# EAGLE design Senslope Alpha 4.8 (EAGLE 8.6.0)
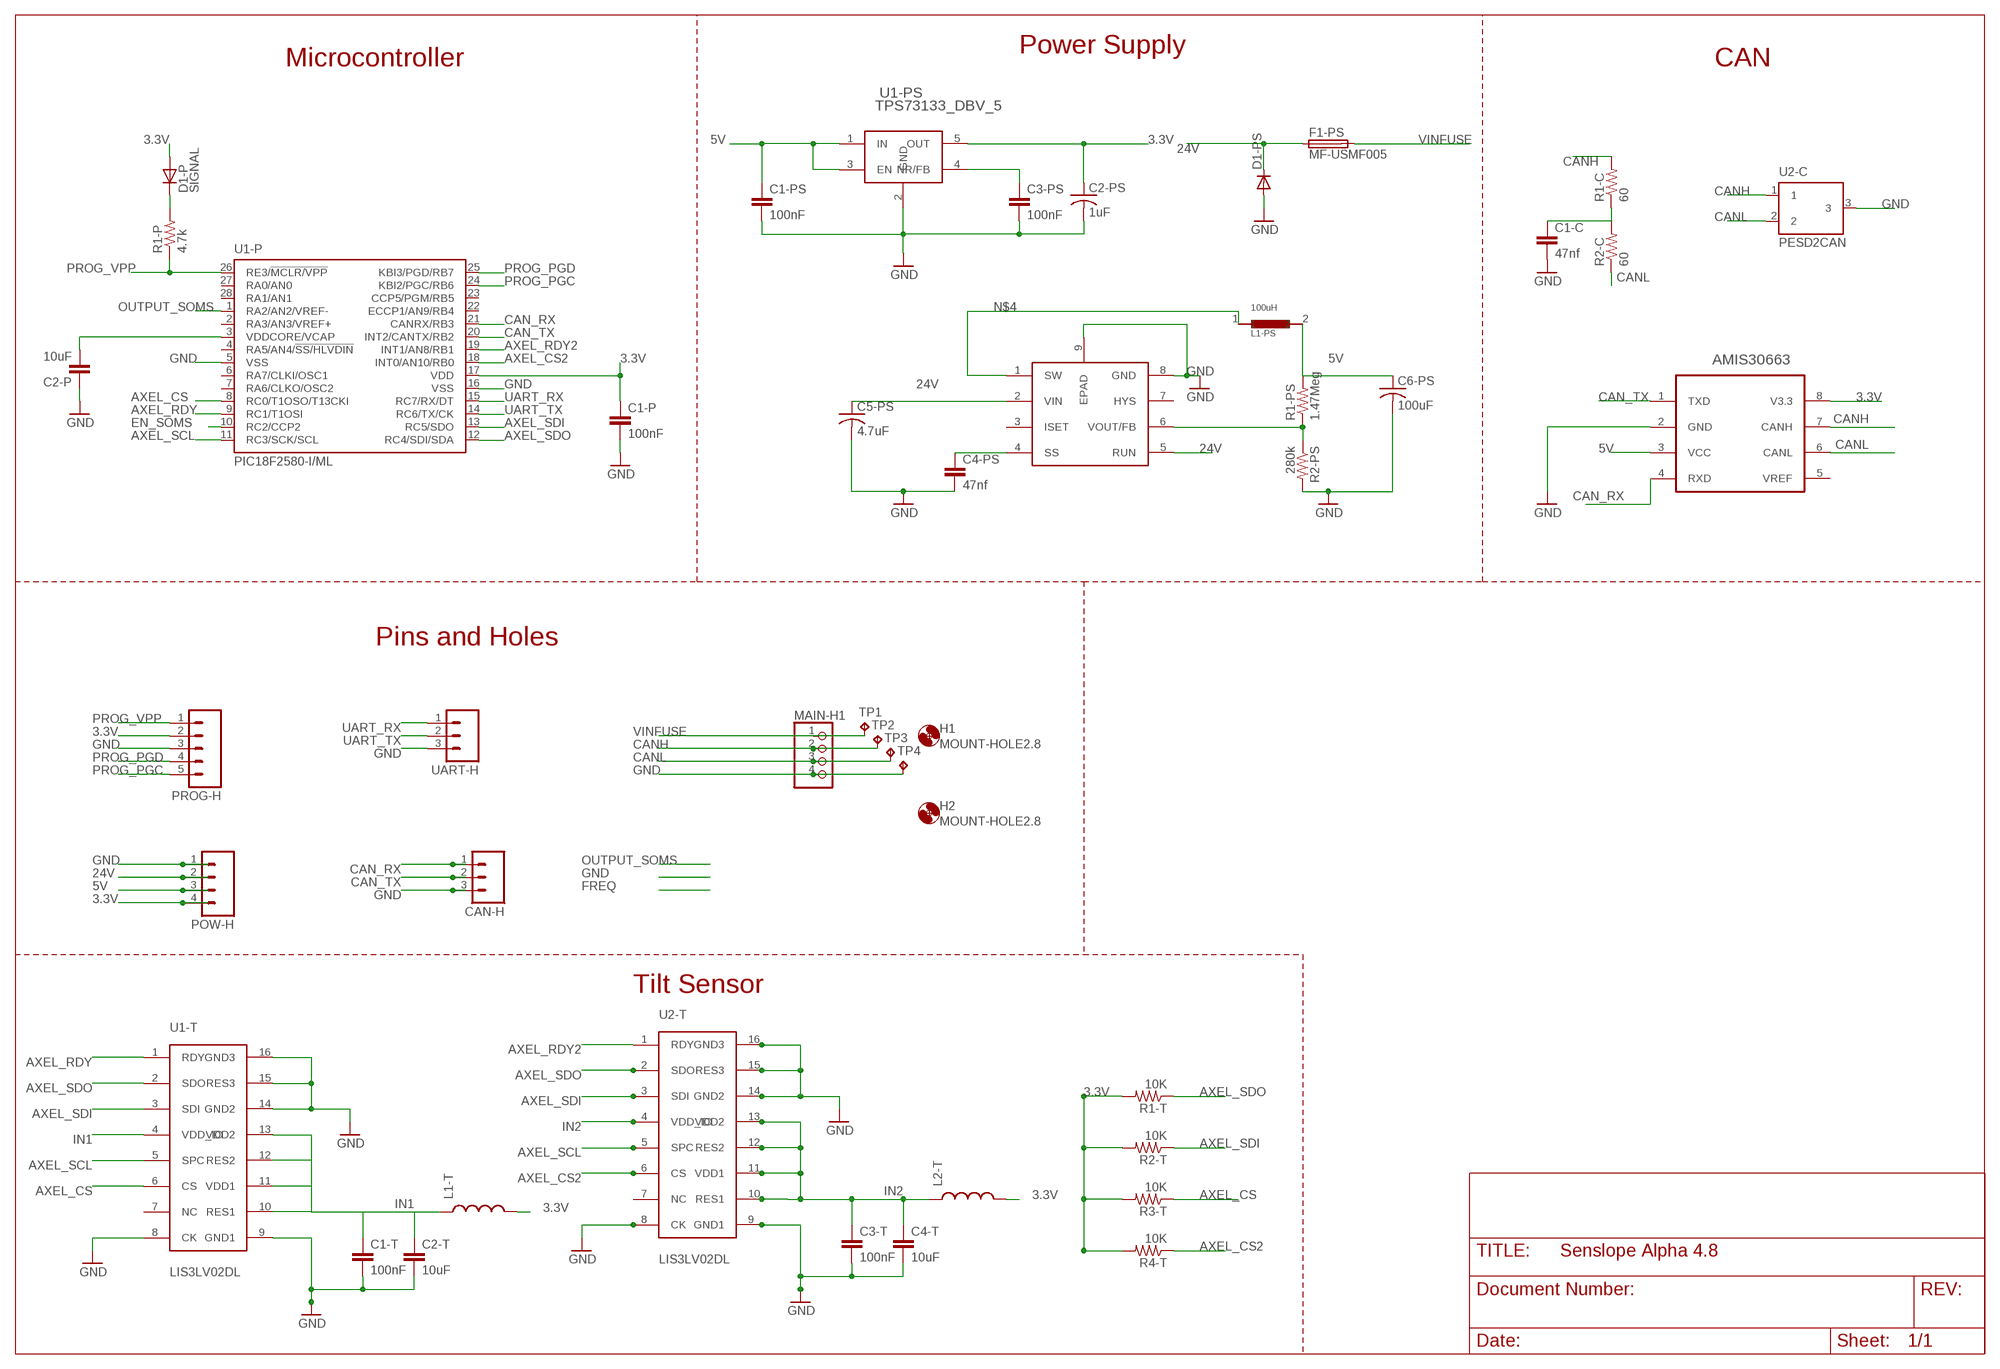
[diagram p0: schematic, sheet 1]

## Parts
C1-C  47nf  C-EUC0805  [C0805]
C1-P  100nF  C-EUC0603  [C0603]
C1-PS  100nF  C-EUC0603  [C0603]
C1-T  100nF  C-EUC0402  [C0402]
C2-P  10uF  C-EUC0603  [C0603]
C2-PS  1uF  C-USC0402  [C0402]
C2-T  10uF  C-EUC0402  [C0402]
C3-PS  100nF  C-EUC0603  [C0603]
C3-T  100nF  C-EUC0402  [C0402]
C4-PS  47nf  C-EUC0805  [C0805]
C4-T  10uF  C-EUC0402  [C0402]
C5-PS  4.7uF  C-USC1206K  [C1206K]
C6-PS  100uF  C-USC1210K  [C1210K]
CAN-H  UART  M031X03_NO_SILK  [1X03_NO_SILK]
D1-P  SIGNAL  DIODE0603  [DIODE-0603]
D1-PS  DIODE-DO-214AC  [DO-214AC]
F1-PS  MF-USMF005  MF-USMF075  [1210]
H1  MOUNT-HOLE2.8  [2,8]
H2  MOUNT-HOLE2.8  [2,8]
L1-PS  100uH  LQH32PN101MN0L  [1210]
L1-T  H2  INDUCTOR0402  [C0402]
L2-T  H1  INDUCTOR0402  [C0402]
MAIN-H1  PINHD-1X04_2.54  [1X04]
POW-H  M041X04_NO_SILK  [1X04_NO_SILK]
PROG-H  M05PTH  [1X05]
R1-C  60  R-US_R0805  [R0805]
R1-P  4.7k  R-US_R0603  [R0603]
R1-PS  1.47Meg  R-US_R0805  [R0805]
R1-T  10K  R-US_R0603  [R0603]
R2-C  60  R-US_R0805  [R0805]
R2-PS  280k  R-US_R0805  [R0805]
R2-T  10K  R-US_R0603  [R0603]
R3-T  10K  R-US_R0603  [R0603]
R4-T  10K  R-US_R0603  [R0603]
TP1  TPTP10SQ  [TP10SQ]
TP2  TPTP10SQ  [TP10SQ]
TP3  TPTP10SQ  [TP10SQ]
TP4  TPTP10SQ  [TP10SQ]
U1-P  PIC18F2580-I/ML  [QFN28-ML_6X6MM]
U1-PS  TPS73133_DBV_5  [DBV5]
U1-T  LIS3LV02DL  [LGA16]
U2  AMIS30663CAN  [SOIC8]
U2-C  PESD2CAN  [SOT23]
U2-PS  LTC3631-5  LTC3631  [MSOP8E]
U2-T  LIS3LV02DL  [LGA16]
UART-H  UART  M031X03_NO_SILK  [1X03_NO_SILK]

## Nets
3.3V: C1-P.1 C2-PS.1 D1-P.A L1-T.2 L2-T.2 POW-H.4 PROG-H.2 R1-T.2 R2-T.2 R3-T.2 R4-T.2 U1-P.17(VDD) U1-PS.5(OUT) U2.8(V3.3)
5V: C1-PS.1 C6-PS.1 L1-PS.2 POW-H.3 R1-PS.2 U1-PS.1(IN) U1-PS.3(EN) U2.3(VCC)
24V: C5-PS.1 D1-PS.1(C) F1-PS.1 POW-H.2 U2-PS.2(VIN) U2-PS.5(RUN)
AXEL_CS: R3-T.1 U1-P.8(RC0/T1OSO/T13CKI) U1-T.6(CS)
AXEL_CS2: R4-T.1 U1-P.18(INT0/AN10/RB0) U2-T.6(CS)
AXEL_RDY: U1-P.9(RC1/T1OSI) U1-T.1(RDY)
AXEL_RDY2: U1-P.19(INT1/AN8/RB1) U2-T.1(RDY)
AXEL_SCL: U1-P.11(RC3/SCK/SCL) U1-T.5(SPC) U2-T.5(SPC)
AXEL_SDI: R2-T.1 U1-P.13(RC5/SDO) U1-T.3(SDI) U2-T.3(SDI)
AXEL_SDO: R1-T.1 U1-P.12(RC4/SDI/SDA) U1-T.2(SDO) U2-T.2(SDO)
CAN_RX: CAN-H.1 U1-P.21(CANRX/RB3) U2.4(RXD)
CAN_TX: CAN-H.2 U1-P.20(INT2/CANTX/RB2) U2.1(TXD)
CANH: MAIN-H1.2 R1-C.2 TP2.TP U2-C.1 U2.7(CANH)
CANL: MAIN-H1.3 R2-C.1 TP3.TP U2-C.2 U2.6(CANL)
EN_SOMS: U1-P.10(RC2/CCP2)
GND: C1-C.2 C1-P.2 C1-PS.2 C1-T.2 C2-P.1 C2-PS.2 C2-T.2 C3-PS.2 C3-T.2 C4-PS.2 C4-T.2 C5-PS.2 C6-PS.2 CAN-H.3 D1-PS.2(A) MAIN-H1.4 POW-H.1 PROG-H.3 R2-PS.2 TP4.TP U1-P.5(VSS) U1-P.16(VSS) U1-PS.2(GND) U1-T.8(CK) U1-T.9(GND1) U1-T.14(GND2) U1-T.15(RES3) U1-T.16(GND3) U2-C.3 U2-PS.8(GND) U2-PS.9(EPAD) U2-T.8(CK) U2-T.9(GND1) U2-T.14(GND2) U2-T.15(RES3) U2-T.16(GND3) U2.2(GND) UART-H.3
IN1: C1-T.1 C2-T.1 L1-T.1 U1-T.4(VDD_IO) U1-T.10(RES1) U1-T.11(VDD1) U1-T.12(RES2) U1-T.13(VDD2)
IN2: C3-T.1 C4-T.1 L2-T.1 U2-T.4(VDD_IO) U2-T.10(RES1) U2-T.11(VDD1) U2-T.12(RES2) U2-T.13(VDD2)
N$3: C1-C.1 R1-C.1 R2-C.2
N$4: L1-PS.1 U2-PS.1(SW)
N$5: C3-PS.1 U1-PS.4(NR/FB)
N$6: R1-PS.1 R2-PS.1 U2-PS.6(VOUT/FB)
N$7: D1-P.C R1-P.2
N$8: C4-PS.1 U2-PS.4(SS)
N$19: C2-P.2 U1-P.3(VDDCORE/VCAP)
OUTPUT_SOMS: U1-P.1(RA2/AN2/VREF-)
PROG_PGC: PROG-H.5 U1-P.24(KBI2/PGC/RB6)
PROG_PGD: PROG-H.4 U1-P.25(KBI3/PGD/RB7)
PROG_VPP: PROG-H.1 R1-P.1 U1-P.26(RE3/!MCLR/VPP)
UART_RX: U1-P.15(RC7/RX/DT) UART-H.1
UART_TX: U1-P.14(RC6/TX/CK) UART-H.2
VINFUSE: F1-PS.2 MAIN-H1.1 TP1.TP
Unconnected: U1-P.2(RA3/AN3/VREF+) U1-P.4(RA5/AN4/!SS/HLVDIN) U1-P.6(RA7/CLKI/OSC1) U1-P.7(RA6/CLKO/OSC2) U1-P.22(ECCP1/AN9/RB4) U1-P.23(CCP5/PGM/RB5) U1-P.27(RA0/AN0) U1-P.28(RA1/AN1) U1-T.7(NC) U2-PS.3(ISET) U2-PS.7(HYS) U2-T.7(NC) U2.5(VREF)

## Notes on the sheet
- Power Supply
- Microcontroller | CAN
- Pins and Holes
- Tilt Sensor

## Library data of the parts
C1-C C1-PS C1-T C2-P C2-T C3-PS C3-T C4-PS C4-T = rcl:C-EU: CAPACITOR, European symbol
C1-P = resistor:C-EU: CAPACITOR, European symbol
C2-PS C5-PS C6-PS = rcl:C-US: CAPACITOR, American symbol
CAN-H UART-H = SparkFun-Connectors:M03: Header 3 Standard 3-pin 0.1" header. Use with straight break away headers (SKU : PRT-00116), right angle break away headers (PRT-00553), swiss pins (PRT-00743), machine pins (PRT-00117), and female headers (PRT-00115). Molex polarized connector foot print use with SKU : PRT-08232 with associated crimp pins and housings.
D1-P = signal_diode:DIODE: Signal diode
D1-PS = dp_devices:DIODE: Various Diode Packages
F1-PS = DRMScustomlib:MF-USMF075
H1 H2 = holes:MOUNT-HOLE: MOUNTING HOLE with drill center marker
L1-PS = 1210_inductor:LQH32PN101MN0L
L1-T L2-T = SparkFun:INDUCTOR: Inductors Basic Inductor/Choke - 0603 and 1206. Footprints are not proven and vary greatly between part numbers.
MAIN-H1 = pinhead-2:PINHD-1X04: PIN HEADER
POW-H = SparkFun-Connectors:M04: Header 4 Standard 4-pin 0.1" header. Use with straight break away headers (SKU : PRT-00116), right angle break away headers (PRT-00553), swiss pins (PRT-00743), machine pins (PRT-00117), and female headers (PRT-00115). Molex polarized connector foot print use with SKU : PRT-08231 with associated crimp pins and housings. 1MM SMD Version SKU: PRT-10208
PROG-H = SparkFun-Connectors:M05: Header 5 Standard 5-pin 0.1" header. Use with straight break away headers (SKU : PRT-00116), right angle break away headers (PRT-00553), swiss pins (PRT-00743), machine pins (PRT-00117), and female headers (PRT-00115). Molex polarized connector foot print use with SKU : PRT-08230 with associated crimp pins and housings.
R1-C R1-PS R2-C R2-PS = rcl:R-US_: RESISTOR, American symbol
R1-P R1-T R2-T R3-T R4-T = resistor:R-US_: RESISTOR, American symbol
TP1-TP4 = testpad:TP: Test pad
U1-P = PIC18f25k80:PIC18F2*80: 28-Pin Enhanced Flash Microcontrollers with ECAN(TM) Technology 10-Bit A/D and nanoWatt Technology Source: http://www.microchip.com .. 39637a.pdf; MF: MICROCHIP; MPN: PIC18F2580-I/ML; OC_FARNELL: 1556180; OC_NEWARK: 71J7242
U1-PS = DRMScustomlib:TPS73133_DBV_5; DATASHEETURL: http://www.ti.com/lit/gpn/TPS73133; DESCRIPTION: Single Output LDO, 150mA, Fixed(3.3V), Cap free, Low Noise, Fast Transient Response; FAMILY_NAME: SINGLE CHANNEL LDO; GENERIC_PART_NUMBER: TPS73133; INDUSTRY_STD_PKG_TYPE: SOT-23; MANUFACTURER: Texas Instruments; MANUFACTURER_PART_NUMBER: tps73133_dbv_5; PACKAGE_DESIGNATOR: DBV; PIN_COUNT: 5; VENDOR: Texas Instruments
U1-T U2-T = LIS3LV02DL:LIS3LV02DL
U2 = khr_lib4:AMIS30663CAN: https://www.onsemi.com/pub/Collateral/AMIS-30663-D.PDF; MPN: AMIS30663; OC_FARNELL: -; OC_NEWARK: 75C7726; PACKAGE: SOIC-8; SUPPLIER: On Semiconductor
U2-C = PESD2CAN:PESD2CAN
U2-PS = DRMScustomlib:LTC3631

## Board
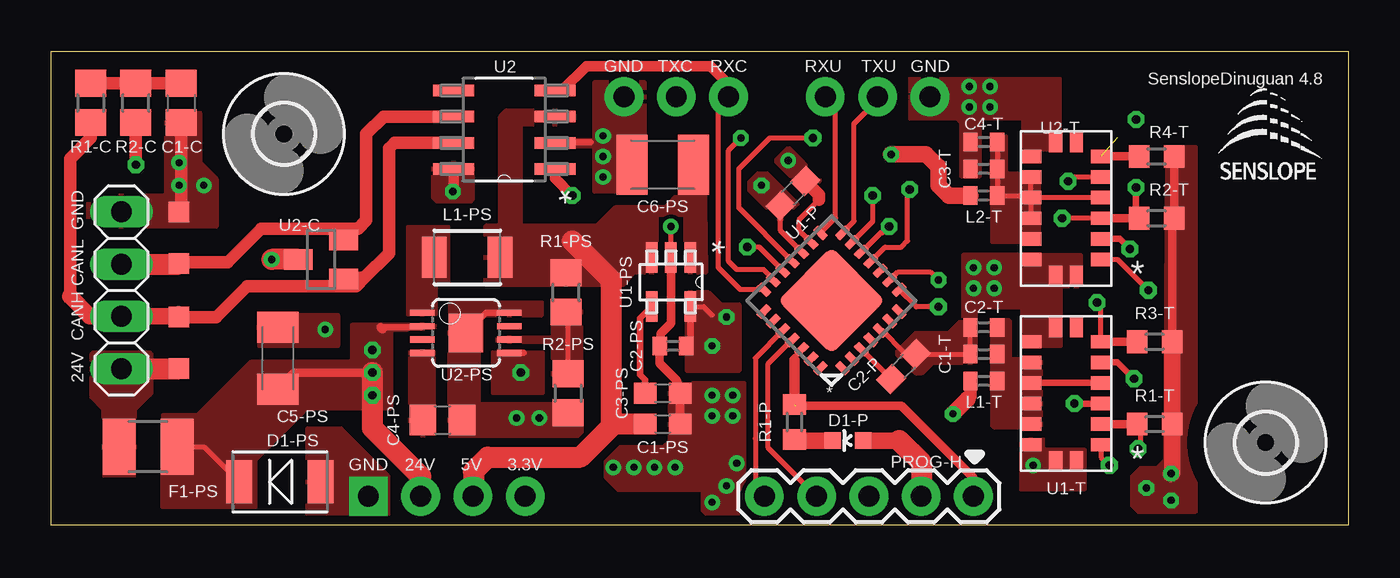
[diagram p1: board, top side]
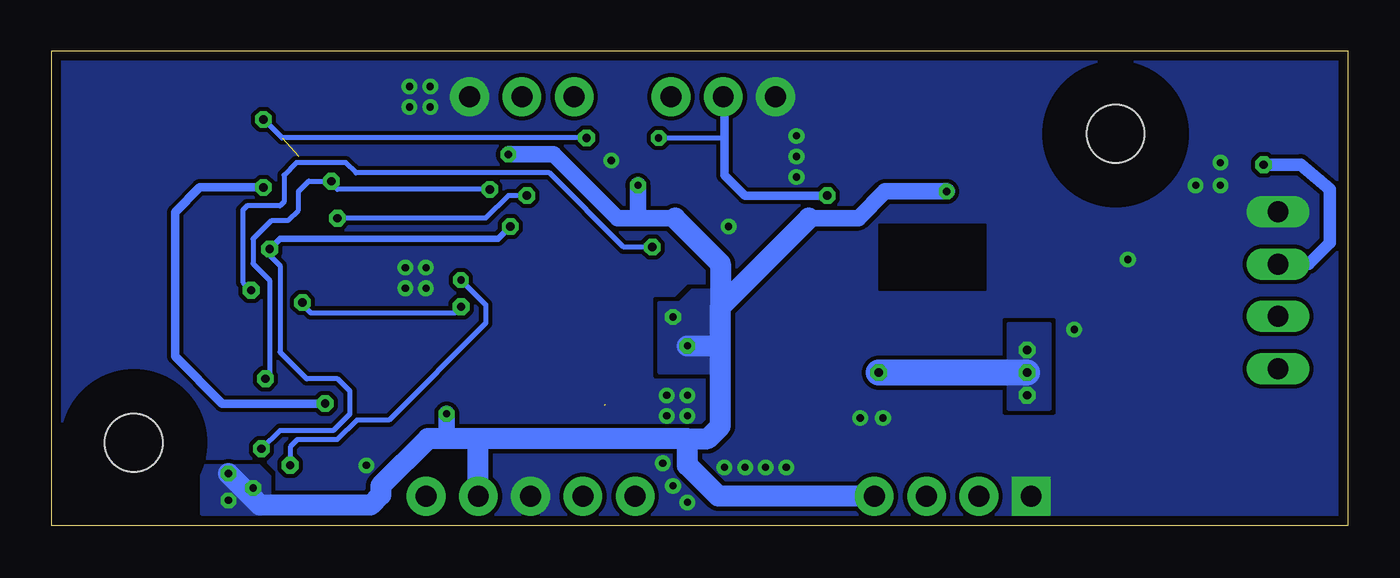
[diagram p2: board, bottom side, seen from below]

Size 63 x 23 mm. Coordinates in mm from the lower left corner, seen from the top.
Outline: 63,23 63,0 0,0 0,23 63,23
Copper layers (1*16): Top 0.035mm / dielectric 0.5mm / Route 0.035mm
Design rules "default *": minimum track width 6mil, minimum drill 6mil, track to track 8mil, track to pad 8mil, pad to pad 8mil, via to via 8mil, smd to smd 0mil, copper to edge 18mil, drill to drill 8mil, minimum pad ring 10mil, minimum via ring 8mil, stop-mask expansion 4mil, vias tented up to drill 0mil, thermal gap 0mil
bRestrict: area 17.6,11.4 to 22.8,14.6

### Footprints (pad centres in the part's own frame; a part is rotated, then mirrored left to right if it is on the bottom)
C0805 = smd 1.3 x 1.5: 1 -0.95,0; 2 0.95,0
C0603 = smd 1.1 x 1: 1 -0.85,0; 2 0.85,0
C0402 = smd 0.7 x 0.9: 1 -0.65,0; 2 0.65,0
C1206K = smd 1.5 x 2: 1 -1.5,0; 2 1.5,0
C1210K = smd 1.5 x 2.9: 1 -1.5,0; 2 1.5,0
1X03_NO_SILK = drill 1.016 pad 1.88: 1 0,0; 2 2.54,0; 3 5.08,0
DIODE-0603 = smd 0.8 x 0.8: A 0,-0.75; C 0,0.75
DO-214AC = smd 1.27 x 2.1: 1 -1.98,0; 2 1.98,0
1210 = smd 1.6 x 2.7: 1 -1.4,0; 2 1.4,0
2,8 = hole 2.8: 0,0
1210' = smd 1.2 x 2: 1 -1.6,0; 2 1.6,0
1X04 = drill 1.016 long: 1 -3.81,0; 2 -1.27,0; 3 1.27,0; 4 3.81,0
1X04_NO_SILK = drill 1.016 pad 1.88 square: 1 0,0 | drill 1.016 pad 1.88: 2 2.54,0; 3 5.08,0; 4 7.62,0
1X05 = drill 1.016 pad 1.88: 1 0,0; 2 2.54,0; 3 5.08,0; 4 7.62,0; 5 10.16,0
R0805 = smd 1.3 x 1.5: 1 -0.95,0; 2 0.95,0
R0603 = smd 1 x 1.1: 1 -0.85,0; 2 0.85,0
TP10SQ = smd 1 x 1: TP 0,0
QFN28-ML_6X6MM = smd 0.7 x 0.35: 1 -2.7,1.95; 2 -2.7,1.3; 3 -2.7,0.65; 4 -2.7,0; 5 -2.7,-0.65; 6 -2.7,-1.3; 7 -2.7,-1.95; 15 2.7,-1.95; 16 2.7,-1.3; 17 2.7,-0.65; 18 2.7,0; 19 2.7,0.65; 20 2.7,1.3; 21 2.7,1.95 | smd 0.35 x 0.7: 8 -1.95,-2.7; 9 -1.3,-2.7; 10 -0.65,-2.7; 11 0,-2.7; 12 0.65,-2.7; 13 1.3,-2.7; 14 1.95,-2.7; 22 1.95,2.7; 23 1.3,2.7; 24 0.65,2.7; 25 0,2.7; 26 -0.65,2.7; 27 -1.3,2.7; 28 -1.95,2.7 | smd 3.7 x 3.7: EXP 0,0
DBV5 = smd 1.473 x 0.559: 1 -1.194,0.94; 2 -1.194,0; 3 -1.194,-0.94; 4 1.194,-0.94; 5 1.194,0.94
LGA16 = smd 0.975 x 0.65: 1 -1.7,2.5; 2 -1.7,1.5; 3 -1.7,0.5; 4 -1.7,-0.5; 5 -1.7,-1.5; 6 -1.7,-2.5; 9 1.7,-2.5; 10 1.7,-1.5; 11 1.7,-0.5; 12 1.7,0.5; 13 1.7,1.5; 14 1.7,2.5 | smd 0.65 x 0.975: 7 -0.5,-3.2; 8 0.5,-3.2; 15 0.5,3.3; 16 -0.5,3.3
SOIC8 = smd 1.981 x 0.559: 1 -0.464,4.405; 2 -0.464,3.135; 3 -0.464,1.865; 4 -0.464,0.595; 5 4.464,0.595; 6 4.464,1.865; 7 4.464,3.135; 8 4.464,4.405
SOT23 = smd 1 x 1.4: 1 -0.95,-1.1; 2 0.95,-1.1; 3 0,1.1
MSOP8E = smd 0.3 x 1.2: 1 0.294,0.427; 2 0.944,0.427; 3 1.594,0.427; 4 2.244,0.427; 5 2.244,4.652; 6 1.594,4.652; 7 0.944,4.652; 8 0.294,4.652 | smd 1.88 x 1.676: 9 1.27,2.54

### Placement (x,y rotation side)
C1-C  6.3,20.5 270 top
C1-P  36.03,16.11 45 top
C1-PS  29.7,4.9 0 top
C1-T  45.3,8.3 180 top
C2-P  41.4,7.7 225 top
C2-PS  30.2,8.7 180 top
C2-T  45.3,9.6 180 top
C3-PS  29.7,6.4 0 top
C3-T  45.3,17.3 180 top
C4-PS  19,5.1 0 top
C4-T  45.3,18.6 180 top
C5-PS  11,8.1 90 top
C6-PS  29.7,17.5 180 top
CAN-H  32.9,20.8 180 top
D1-P  38.7,4.1 90 top
D1-PS  11.1,2.1 0 top
F1-PS  4.7,3.8 180 top
H1  59,4 0 top
H2  11.3,19 0 top
L1-PS  100uH  [1210']  20.2,13 0 top
L1-T  45.3,7 180 top
L2-T  45.3,16 180 top
MAIN-H1  3.4,11.4 90 top
POW-H  15.4,1.4 0 top
PROG-H  44.8,1.4 180 top
R1-C  1.9,20.5 270 top
R1-P  36.1,5 270 top
R1-PS  25,11.3 90 top
R1-T  53.6,4.9 0 top
R2-C  4.1,20.5 90 top
R2-PS  25.1,6.4 270 top
R2-T  53.7,14.9 0 top
R3-T  53.6,8.9 0 top
R4-T  53.7,17.9 0 top
TP1  6.2,7.6 0 top
TP2  6.2,10.1 0 top
TP3  6.2,12.7 0 top
TP4  6.2,15.2 0 top
U1-P  37.9,10.9 135 top
U1-PS  30.1,11.8 270 top
U1-T  49.3,6.4 180 top
U2  24,21.7 180 top
U2-C  13.1,12.9 90 top
U2-PS  17.6,10.6 270 top
U2-T  49.3,15.4 180 top
U$1  [LOGO_SML_TNAME]  59,18.4 0 top
UART-H  37.6,20.8 0 top

### Tracks (layer width: path | path; a pad name or v marks a point on that pad's centre or on a via)
3.3V  (via drill 0.35)
  Top 0.254: U1-PS.5 31.69,10.61 32.1,10.2 | U1-P.17 35.43,14.29 C1-P.1
  Top 0.305: U1-PS.5 31.04,8.89 C2-PS.1
  Top 0.406: R4-T.2 R2-T.2 54.45,14.8 R3-T.2
  Top 0.508: U2.8 19.54,16.24 v19.5,16.2
  Top 0.61: L1-T.2 44.65,6.25 44.5,6.1
  Top 0.813: R3-T.2 R1-T.2 54.45,2.55 v54.4,2.5 | L2-T.2 43.6,16 43.1,16.5 43.1,17.4 42.5,18 v40.8,18 | D1-P.A 41.2,4.1 | 44.5,6.1 v43.8,5.4
  Top 1.016: PROG-H.2 42.26,3.04 41.2,4.1
  Route 0.813: v43.8,5.4 43.8,4.2 | v40.8,18 38.6,18 35.5,14.9 34.5,14.9 | 34.5,14.9 32.7,14.9 | 26.2,14.9 23.8,14.9 22.5,16.2 v19.5,16.2 | v34.5,16.5 34.5,14.9
  Route 1.016: POW-H.4 30.6,1.4 32.1,2.9 32.1,4.2 | 42.3,4.2 43.8,4.2 44.7,4.2 47,1.9 47,1.47 47.5,0.96 52.87,0.96 v54.4,2.5 | PROG-H.2 42.26,4.16 42.3,4.2 | 30.5,8.7 30.5,4.8 31.1,4.2 32.1,4.2 | 30.5,8.7 30.5,10.6 | 30.5,10.6 26.2,14.9 | 32.7,14.9 30.5,12.7 30.5,10.6 | v32.1,8.7 30.5,8.7 | 32.1,4.2 42.3,4.2
  other vias: 54.4,1.2 53.2,1.8 32.8,10.1
  pour Top (isolate 0.254): 54.2,18.4 55.6,18.4 55.6,0.6 52.8,0.6 52.5,0.9 52.5,2.4 52.9,2.8 53.7,2.8 54.1,3.2
  pour Top: 30.9,11.3 31.9,11.3 32.5,10.7 33.4,10.7 33.4,7.5 30.9,7.5
  pour Top: 35.4,14.7 33.9,16.2 33.9,16.7 34.3,17.1 34.8,17.1 36.3,15.6
  pour Route (rank 2): 52.9,2.9 52.4,2.4 52.4,0.9 52.8,0.5 55.7,0.5 55.7,2.9
  pour Top: 18.5,17.6 18.5,15.9 18.7,15.7 20.4,15.7 20.5,15.8 20.5,17.6
  pour Route: 31.3,11.4 31.9,11.4 32.5,10.8 33.5,10.8 33.5,7.4 30.9,7.4 30.9,11.4
5V
  Top 1.016: 25.3,13.8 27.2,11.9 27.2,4.9 | 27.2,4.9 27.2,4.8 25.7,3.3 21.2,3.3 20.5,2.6 20.5,1.42 POW-H.3 | C1-PS.1 27.2,4.9
  pour Top: 21.1,14.5 21.1,11.7 27.8,11.7 28.3,12.3 29.4,12.3 29.4,15.1 30.8,15.1 30.8,12.3 31.8,12.3 31.7,18.8 30.6,18.8 30.6,16.2 29.8,15.4 27.4,15.4 26.5,14.5 22.8,14.5 22.8,19.5 25.4,19.5 25.4,20.1 22.1,20.1 21.8,19.8 21.8,14.5
24V  (via drill 0.4)
  Top 0.254: F1-PS.1 7.42,3.8 D1-PS.1
  Top 0.305: 16,9.6 17.97,9.6 U2-PS.2 | U2-PS.5 22.94,8.36
  Top 0.406: 16.1,9.5 16,9.6 | v15.6,7.4 11.8,7.4 C5-PS.1
  Top 1.016: POW-H.2 17.94,2.36 15.6,4.7 v15.6,7.4
  Route 1.27: v15.6,7.4 v22.8,7.4
  other vias: 15.6,6.3 15.6,8.5
  pour Top (isolate 0.254): 5.4,5.3 5.4,0.9 9.9,0.9 9.9,3.2 12.4,5.7 16.5,5.7 16.5,9.5 18.6,9.5 18.6,9.7 14.6,9.7 14.6,7.9 9.7,7.9 7.1,5.3
  pour Top: 21.4,8.4 21.4,6.4 23.9,6.4 23.9,8.4
  pour Route: 16.5,5.6 16.5,9.8 14.5,9.8 14.5,5.6
AXEL_CS  (via drill 0.4)
  Top 0.254: U1-T.6 51,10.6 v50.8,10.8 | v43.1,10.6 42.02,10.6 U1-P.8
  Top 0.406: R3-T.1 U1-T.6
  Route 0.254: v50.8,10.8 50.8,10.7 50.4,10.3 43.4,10.3 v43.1,10.6
AXEL_CS2  (via drill 0.4)  (1 unrouted)
  Top 0.254: U1-P.18 33.4,15.4 33.4,17.3 34.9,18.8 v37,18.8 | 52.9,17.95 R4-T.1
  Top 0.406: U2-T.6 R4-T.1
  Route 0.254: v37,18.8 51.8,18.8 v52.7,19.7
AXEL_RDY  (via drill 0.35, 0.4)
  Top 0.254: U1-T.1 51,3.3 v51.4,2.9 | 40.79,11.89 U1-P.9 41.14,12.3 42.7,12.3 v43.1,11.9
  Route 0.254: v43.1,11.9 41.9,10.7 41.9,9.8 46.6,5.1 48.15,5.1 49.11,4.14 51.06,4.14 51.4,3.8 v51.4,2.9
AXEL_RDY2  (via drill 0.4)
  Top 0.254: U1-P.19 35.53,12.37 34.4,13.5 v33.8,13.5 | U2-T.1 51.8,12.9 v53.3,11.4
  Route 0.254: v53.3,11.4 53.7,11.8 53.7,15.3 53.5,15.5 51.9,15.5 51.7,15.7 51.7,17 51.1,17.6 48.7,17.6 48.2,17.1 38.8,17.1 35.2,13.5 v33.8,13.5
AXEL_SCL  (via drill 0.4)
  Top 0.254: U1-P.11 40.5,13.5 41.3,13.5 41.6,13.8 41.6,16.2 v41.7,16.3 | U2-T.5 49.6,16.9 v49.4,16.7
  Top 0.305: U1-T.5 51.8,7.9 v52.6,7.1
  Route 0.254: v52.6,7.1 52.4,7.3 52.4,11.9 53.2,12.7 53.2,13.9 52.3,14.8 51.5,14.8 51,15.3 51,16.2 50.5,16.7 v49.4,16.7 49.4,16.6 49.1,16.3 v41.7,16.3
AXEL_SDI  (via drill 0.4)
  Top 0.254: U2-T.3 v49.1,14.9 | v39.9,16 39.9,14.74 U1-P.13
  Top 0.305: U1-T.3 v49.7,5.9 | R2-T.1 52.7,15.05 v52.7,16.4
  Top 0.406: U2-T.3 R2-T.1
  Route 0.254: v39.9,16 40.8,16 41.9,14.9 v49.1,14.9
  Route 0.406: v52.7,16.4 55.8,16.4 57,15.2 57,8.2 54.7,5.9 v49.7,5.9
AXEL_SDO  (via drill 0.4)
  Top 0.254: U1-P.12 39.37,13.27 40.3,14.2 40.4,14.2 v40.7,14.5 | R1-T.1 52.9,4.75 52.9,3.8 v52.8,3.7
  Top 0.305: U2-T.2 51.9,13.9 v52.4,13.4
  Top 0.406: U1-T.2 R1-T.1 52.8,4.9
  Route 0.254: v52.4,13.4 52.4,13.1 51.9,12.6 51.9,8.4 50.6,7.1 49.1,7.1 48.5,6.5 48.5,5.4 49.3,4.6 51.9,4.6 v52.8,3.7
  Route 0.305: v52.4,13.4 51.9,13.9 41.3,13.9 v40.7,14.5
CAN_RX
  Top 0.254: U1-P.21 33.47,11.43 32.4,12.5 32.4,20.3 CAN-H.1
  Top 0.508: U2.4 24.8,21.11 25.99,22.29 32.01,22.29 32.9,21.4 CAN-H.1
CAN_TX  (via drill 0.35, 0.4)
  Top 0.254: U1-P.20 35.07,11.93 34.6,12.4 33.3,12.4 32.9,12.8 32.9,18.2 v33.5,18.8
  Top 0.508: U2.1 24.46,16.84 v25.3,16
  Route 0.254: v33.5,18.8 30.4,18.8 30.3,18.7
  Route 0.406: v25.3,16 29.3,16 30.3,17 30.3,18.7 30.3,20.54 CAN-H.2
CANH
  Top 0.61: R1-C.2 1.9,18.8 0.9,17.8 0.9,11.1 | U2.7 16.66,18.57 16.4,18.3 16.4,13.2 15.2,12 | 15.2,12 14.25,12 U2-C.1 | TP2.TP 8,10.1 9.5,11.6 14.8,11.6 15.2,12
  Top 0.813: 0.9,11.1 1.87,10.13 MAIN-H1.2 6.17,10.13
  Top 1.016: 6.17,10.13 TP2.TP
CANL  (via drill 0.4)
  Top 0.61: R2-C.1 v4.1,17.5 | TP3.TP 6.27,12.77 8.57,12.77 10.2,14.4 14.5,14.4 | 14.5,14.4 14.9,14.4 15.3,14.8 15.3,19 16.14,19.84 U2.6 | U2-C.2 14.2,14.1 14.5,14.4
  Top 1.016: MAIN-H1.3 6.17,12.67 TP3.TP
  Route 0.61: v4.1,17.5 2.3,17.5 0.9,16.3 0.9,13.7 1.9,12.7 3.37,12.7 MAIN-H1.3
GND  (via drill 0.35)
  Top 0.254: U1-P.5 40.35,9.45 41.4,8.4 41.9,8.4 C2-P.1 C1-T.2 C2-T.2 | U1-P.16 36.3,14.34 36.3,14.8 37.3,15.8 | U1-PS.2 30.1,14.4
  Top 0.305: U2-PS.8 21.12,10.31 U2-PS.9 | 26.2,18.6 24.5,18.6 U2.2
  Top 0.406: U1-PS.2 30.1,9.8 29.6,9.3 29.6,8.75 C2-PS.2 29.55,7.85 30.4,7 30.4,6.35 C3-PS.2 C1-PS.2
  Top 0.61: C1-C.2 6.3,15.71 | C1-P.2 37.3,16.04 37.3,15.8
  Top 1.016: U2-C.3 v10.7,12.9
  other vias: 13.3,9.5 7.4,16.5 6.2,16.5 26.8,18.9 26.8,17.9 30.1,14.5 23.7,5.2 22.6,5.2 44.8,12.5 45.8,12.5 45.8,11.5 44.8,11.5 35.8,17.7 32.1,6.3 47.7,2.9 44.6,20.3 45.6,20.3 45.6,21.3 44.6,21.3 33.1,6.3 33.1,5.3 32.1,5.3 26.8,16.9 30.3,2.8 29.3,2.8 28.3,2.8 27.3,2.8 32.1,1.1 33.3,3 6.2,17.6 32.8,1.9
  pour Top (isolate 0.254): 47.2,13.1 50,13.1 50,11.6 49,11.6 49,8.7 47.2,8.7
  pour Top (isolate 0.254): 41.7,19.7 41.7,21.7 49,21.7 49,18.3 48.9,18.2 48.1,18.2 48,18.1 48,17.9 47.8,17.7 47.3,17.7 47.2,17.8 47.2,19.7 45.3,19.7 45.1,19.5 45.1,16.9 44.2,16.9 44.2,19.5 44,19.7
  pour Top (isolate 0.254): 1.8,14.9 1.8,15.6 2.2,16 5.6,16 5.6,20 5.7,20.1 7.1,20.1 7.2,20 7.2,17.6 8,16.8 8,14.5 2.2,14.5
  pour Top (isolate 0.254): 44.9,7.9 44.9,10.6 47.7,10.6 47.7,10.7 47.8,10.7 47.8,13.1 44.3,13.1 44.3,10 43.6,9.3 42,9.3 41.1,8.4 41.1,8.3 42,7.4 42.3,7.4 42.8,7.9
  pour Top (isolate 0.254): 37.3,16.7 37.3,16.8 35.8,18.3 35.2,17.7 36.7,16.2 36.8,16.2
  pour Top (isolate 0.254): 10.1,10.2 13.9,10.2 13.9,8.7 10.1,8.7
  pour Top (isolate 0.254): 12.4,4.7 12.4,0.3 16.3,0.3 16.4,0.4 16.4,2.4 14.1,4.7
  pour Top: 19.3,10.1 19.3,4.3 25.8,4.3 25.8,5.9 20.8,5.9 20.8,10.1
  pour Top: 19.4,8.4 19.4,10.8 23.8,10.8 23.8,10.2 20.8,10.2 20.8,8.4
  pour Top: 26.4,21.5 28.8,21.5 28.8,16.2 26.4,16.2 26.4,18.4 23.6,18.4 23.6,18.7 26.4,18.7
  pour Top: 30,6.9 30,4.1 29.7,3.8 27.6,3.8 26.9,3.1 26.9,2.3 27.5,1.7 31.6,1.7 31.6,0.7 31.8,0.5 33.4,0.5 33.4,1.6 33.7,2.2 33.7,6.9
  pour Route (rank 6): 0,23 63,23 63,0 0,0
  pour Top: 47.1,4.2 48.2,4.2 48.2,3.7 50.2,3.7 50.2,1.7 47.1,1.7
IN1
  Top 0.305: U1-T.11 U1-T.4
  pour Top (isolate 0.254): 48.1,8.1 48.1,4.7 45.8,4.7 45.7,4.8 45.7,9.9 45.8,10 46.5,10 46.6,9.9 46.6,8.1
IN2
  Top 0.254: C4-T.1 C3-T.1 L2-T.1 47.5,16 U2-T.11 | U2-T.11 U2-T.10 | U2-T.4 U2-T.11 | U2-T.11 U2-T.12
  pour Top (isolate 0.254): 45.7,13.7 45.7,18.9 45.8,19 46.3,19 46.4,18.9 46.4,17.1 47.9,17.1 48,17 48,13.8 47.9,13.7
N$3
  Top 0.61: R1-C.1 R2-C.2 C1-C.1
N$4
  pour Top (isolate 0.254): 18.7,10.2 17.3,10.2 17.3,14.5 19.3,14.5 19.3,11.7 18.7,11.7
N$5
  Top 0.305: C3-PS.1 28.85,7.05 28.6,7.3 28.6,10.05 U1-PS.4
N$6
  Top 0.254: R2-PS.1 25.1,10.25 R1-PS.1
  pour Top: 24.4,6.8 24.4,10.9 25.7,10.9 25.7,6.8
  pour Top: 21.7,9.1 24.5,9.1 24.5,8.9 21.7,8.9
N$7
  Top 0.254: 37.9,4.15 D1-P.C
  Top 0.813: R1-P.2 36.15,4.1 D1-P.C
N$8
  pour Top: 17.4,8.5 18.6,8.5 18.6,4.3 17.4,4.3
N$19
  Top 0.254: U1-P.3 39.37,8.53 C2-P.2
PROG_PGC
  Top 0.254: U1-P.24 35.53,9.43 34.2,8.1 34.2,4.2 34.2,1.84 PROG-H.5
PROG_PGD
  Top 0.254: U1-P.25 34.8,7.8 34.8,3.78 PROG-H.4
PROG_VPP  (1 unrouted)
  Top 0.254: 36.43,8.53 U1-P.26 36.1,8.18 36.1,8 | R1-P.1 35.9,6.05
  Top 0.406: PROG-H.1 44.8,2.3 41.3,5.8 36.15,5.8
  Top 0.508: 36.1,8 R1-P.1
UART_RX
  Top 0.254: U1-P.15 38.1,14.92 38.1,20.6 37.9,20.8 UART-H.1
UART_TX
  Top 0.254: U1-P.14 39,14.76 39,19.5 40.14,20.64 UART-H.2
VINFUSE
  Top 1.016: MAIN-H1.1 TP1.TP
  pour Top: 2.5,2.4 4.1,2.4 4.1,5.6 4.8,6.3 4.9,6.4 4.9,8.3 4.8,8.4 2,8.4 1.9,8.3 1.9,6.2 2.5,5.6

### Text on the board
tNames: GND | TXC | RXC | RXU | TXU | GND | SenslopeDinuguan 4.8 | GND | CANL | CANH | 24V | * | GND | 24V | 5V | 3.3V